# Altium project AMC_Box_Mainboard.PrjPCB (part 1 of 4)
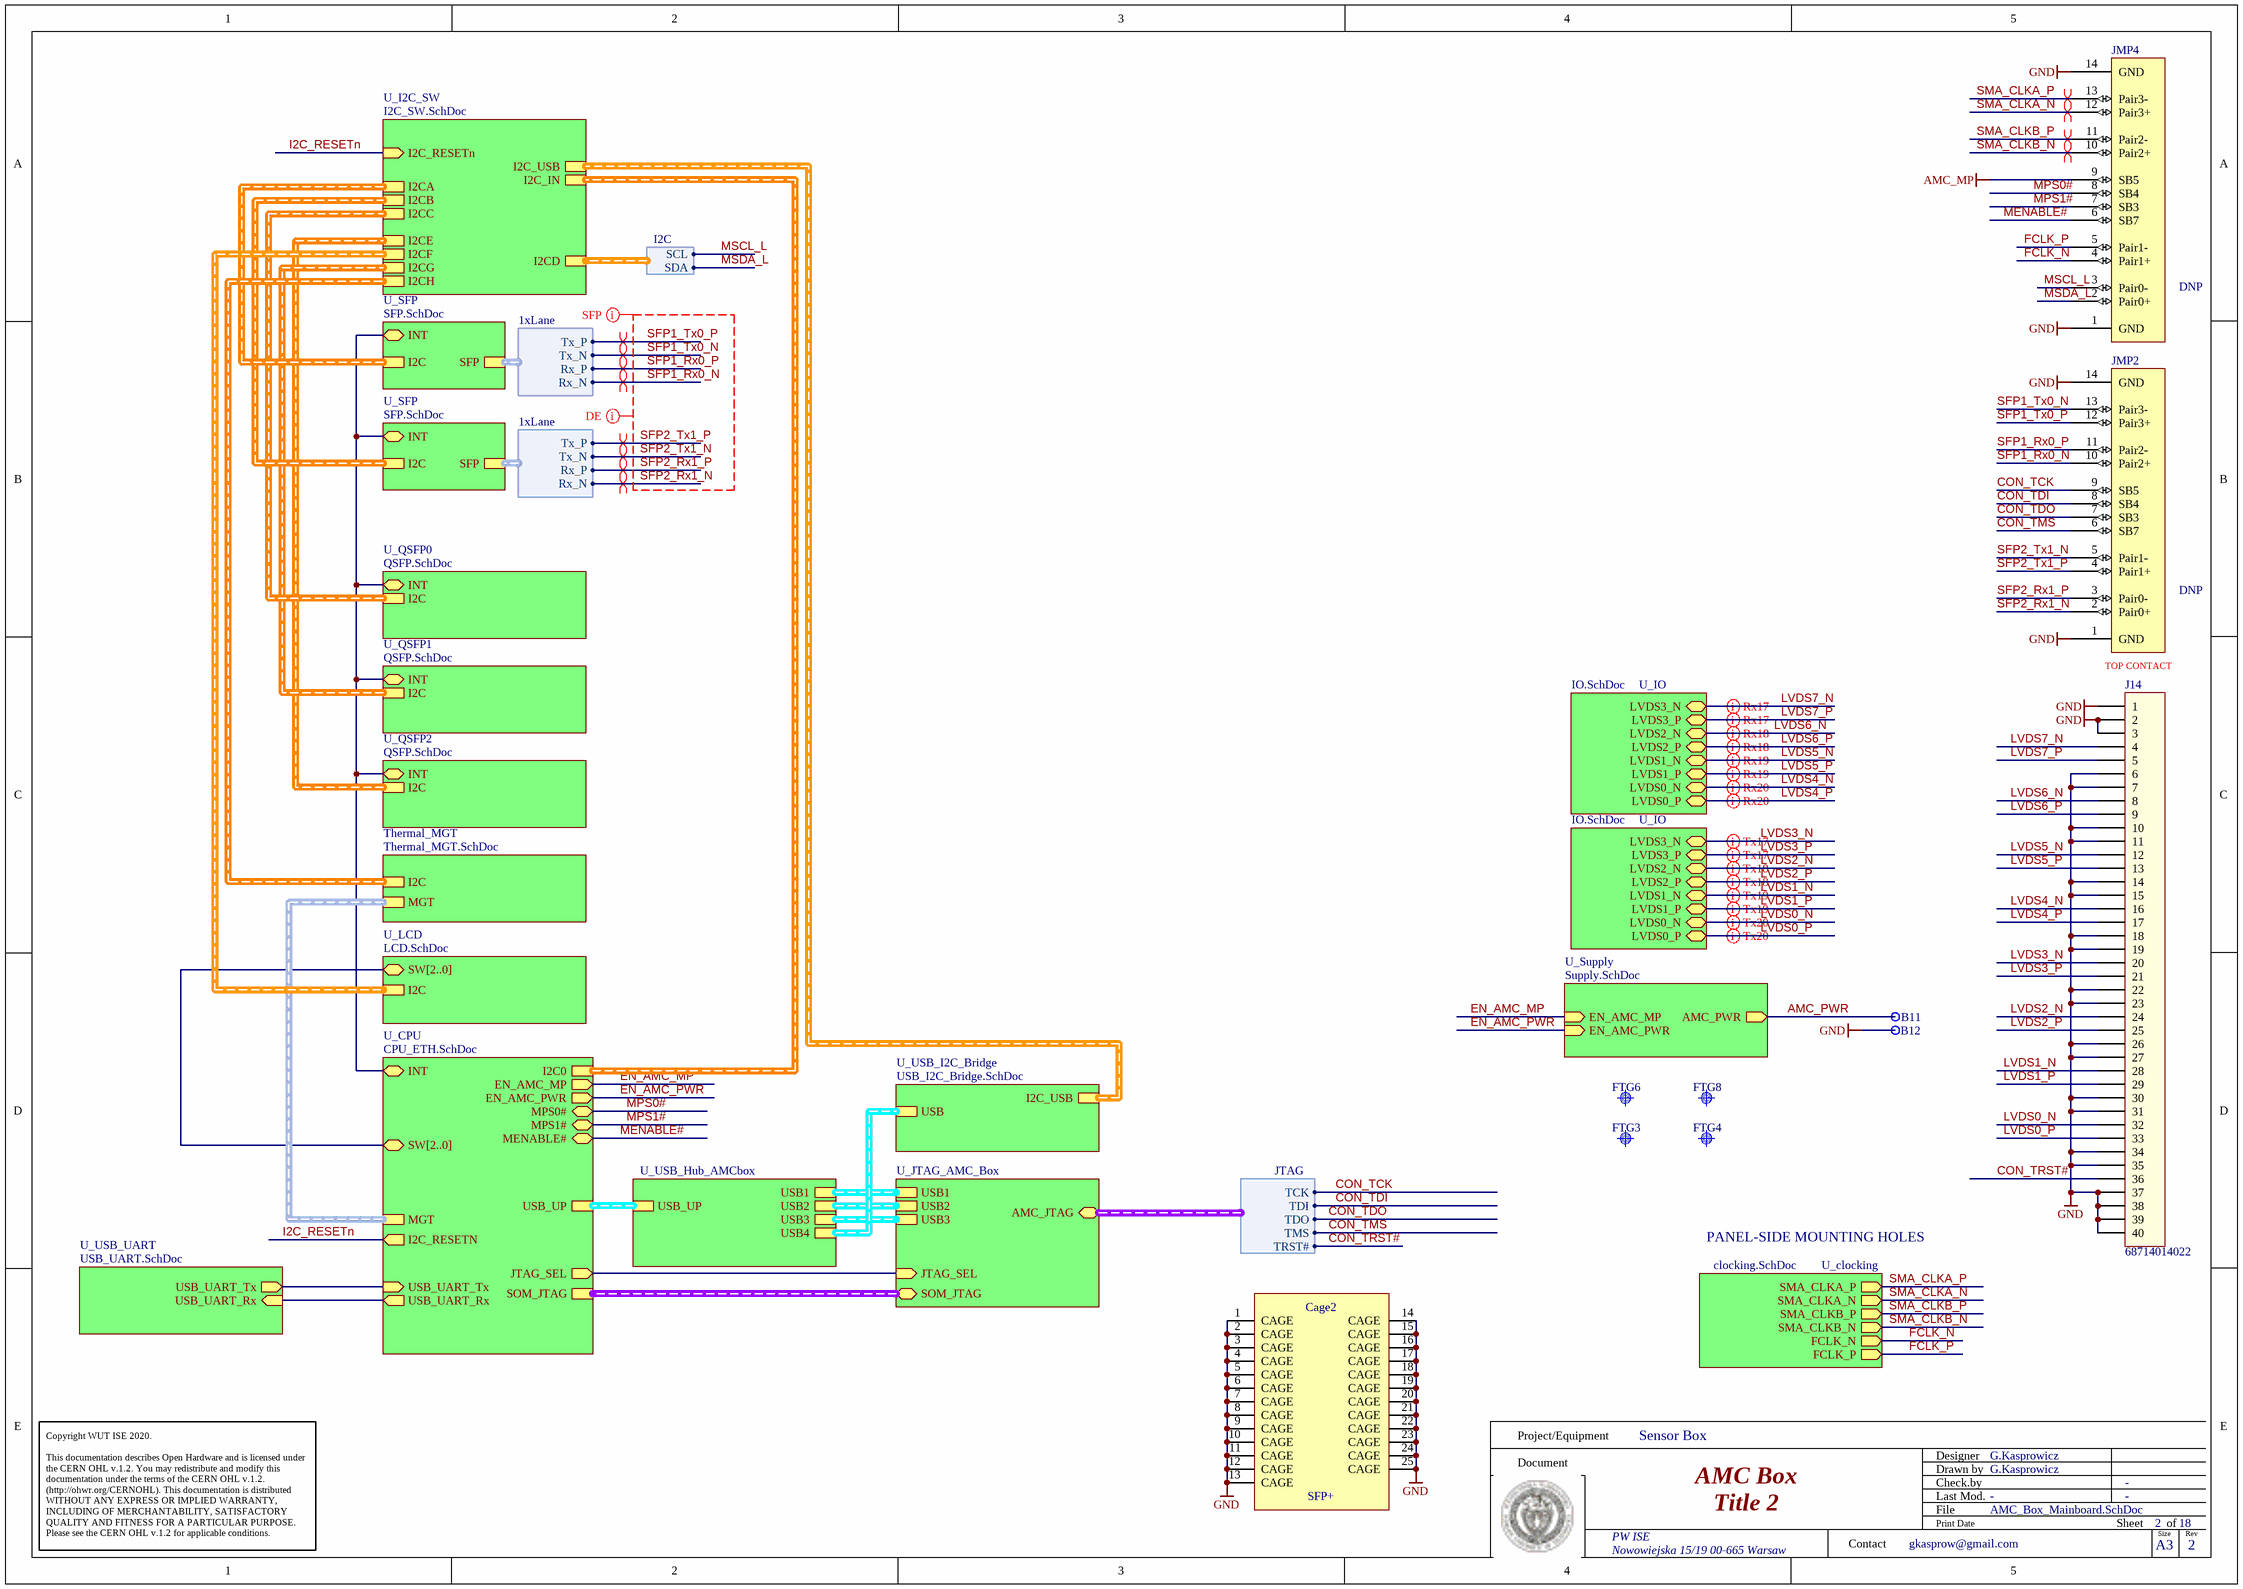
[diagram p0: AMC_Box_Mainboard.SchDoc]
14 sheets, 505 parts. Net scope: hierarchical (ports join the sheet entries above them; power ports are global).
Board file: AMC_Box_Mainboard.PcbDoc
Sheets:
  AMC_Box_Mainboard.SchDoc
    U_Supply = Supply.SchDoc
    U_clocking = clocking.SchDoc
    U_IO = IO.SchDoc
    U_IO = IO.SchDoc
    U_SFP = SFP.SchDoc
    U_SFP = SFP.SchDoc
    U_I2C_SW = I2C_SW.SchDoc
    Thermal_MGT = Thermal_MGT.SchDoc
    U_CPU = CPU_ETH.SchDoc
    U_LCD = LCD.SchDoc
    U_USB_Hub_AMCbox = USB_Hub_AMCbox.SchDoc
    U_USB_UART = USB_UART.SchDoc
    U_JTAG_AMC_Box = JTAG_AMC_Box.SchDoc
    U_USB_I2C_Bridge = USB_I2C_Bridge.SchDoc
    U_QSFP0 = QSFP.SchDoc
    U_QSFP1 = QSFP.SchDoc
    U_QSFP2 = QSFP.SchDoc

## Sheet AMC_Box_Mainboard.SchDoc: AMC Box
size 420 x 297 mm; Author: G.Kasprowicz; CompanyName: WUT ISE; DrawnBy: G.Kasprowicz; Organization: WUT ISE; Address1: PW ISE; Address2: Nowowiejska 15/19 00-665 Warsaw; Address3: gkasprow@gmail.com; DocumentNumber: 2; Revision: 2; SheetNumber: 2; SheetTotal: 18; ModifiedBy: -; CheckedDate: -; Title2: Title 2; DivGrp: WUT ISE; Designer: G.Kasprowicz; ModifiedDate: -; ProjectName: Sensor Box

### Parts
B11  Plated Hole  [c200h150]  (value not drawn)
B12  Plated Hole  [c200h150]  (value not drawn)
Cage2  SFP+  [TYCO_2007263-1]
FTG3  Use only in PCB  [FIDUCIAL_TOP_S100-200]  (value not drawn)
FTG4  Use only in PCB  [FIDUCIAL_TOP_C100-200]  (value not drawn)
FTG6  Use only in PCB  [FIDUCIAL_TOP_S100-200]  (value not drawn)
FTG8  Use only in PCB  [FIDUCIAL_TOP_C100-200]  (value not drawn)
J14  68714014022  [68714014022]
JMP2  DNP  [3M_Twinax_SL8801/12-10DA5-00]
JMP4  DNP  [3M_Twinax_SL8801/12-10DA5-00]

### Sub-sheets
Thermal_MGT = Thermal_MGT.SchDoc: I2C (harness I2C), MGT (harness THERM_MGT)
U_clocking = clocking.SchDoc: SMA_CLKA_P (out), SMA_CLKA_N (out), SMA_CLKB_P (out), SMA_CLKB_N (out), FCLK_N (out), FCLK_P (out)
U_CPU = CPU_ETH.SchDoc: I2C0 (harness I2C), MGT (harness THERM_MGT), EN_AMC_MP (out), EN_AMC_PWR (out), MPS0# (bidir), MPS1# (bidir), MENABLE# (bidir), SW[2..0] (bidir), I2C_RESETN (out), USB_UP (harness USB), USB_UART_Tx (in), USB_UART_Rx (out), SOM_JTAG (harness JTAG), JTAG_SEL (out), INT (bidir)
U_I2C_SW = I2C_SW.SchDoc: I2C_RESETn (in), I2CE (harness I2C), I2CB (harness I2C), I2CA (harness I2C), I2CD (harness I2C), I2CC (harness I2C), I2CG (harness I2C), I2CF (harness I2C), I2CH (harness I2C), I2C_IN (harness I2C), I2C_USB
U_IO = IO.SchDoc: LVDS3_N (bidir), LVDS3_P (bidir), LVDS2_N (bidir), LVDS2_P (bidir), LVDS1_N (bidir), LVDS1_P (bidir), LVDS0_N (bidir), LVDS0_P (bidir)
U_IO = IO.SchDoc: LVDS3_N (bidir), LVDS3_P (bidir), LVDS2_N (bidir), LVDS2_P (bidir), LVDS1_N (bidir), LVDS1_P (bidir), LVDS0_N (bidir), LVDS0_P (bidir)
U_JTAG_AMC_Box = JTAG_AMC_Box.SchDoc: AMC_JTAG (bidir, harness JTAG), SOM_JTAG (bidir, harness JTAG), USB1 (harness USB), USB2 (harness USB), USB3 (harness USB), JTAG_SEL (in)
U_LCD = LCD.SchDoc: I2C, SW[2..0] (bidir)
U_QSFP0 = QSFP.SchDoc: I2C (harness I2C), INT (bidir)
U_QSFP1 = QSFP.SchDoc: I2C (harness I2C), INT (bidir)
U_QSFP2 = QSFP.SchDoc: I2C (harness I2C), INT (bidir)
U_SFP = SFP.SchDoc: I2C (harness I2C), SFP (harness 1xLane), INT (bidir)
U_SFP = SFP.SchDoc: I2C (harness I2C), SFP (harness 1xLane), INT (bidir)
U_Supply = Supply.SchDoc: AMC_PWR (out), EN_AMC_MP (in), EN_AMC_PWR (in)
U_USB_Hub_AMCbox = USB_Hub_AMCbox.SchDoc: USB1 (harness USB), USB2 (harness USB), USB3 (harness USB), USB4 (harness USB), USB_UP (harness USB)
U_USB_I2C_Bridge = USB_I2C_Bridge.SchDoc: I2C_USB (harness I2C), USB (harness USB)
U_USB_UART = USB_UART.SchDoc: USB_UART_Rx (in), USB_UART_Tx (out)

### Harnesses
1xLane: Rx_P, Rx_N, Tx_P, Tx_N
I2C: SCL, SDA
JTAG: TCK, TMS, TDI, TDO, TRST#

### Nets
AMC_MP: JMP4.9(SB5)
GND: B12.1 Cage2.1(CAGE) Cage2.2(CAGE) Cage2.3(CAGE) Cage2.4(CAGE) Cage2.5(CAGE) Cage2.6(CAGE) Cage2.7(CAGE) Cage2.8(CAGE) Cage2.9(CAGE) Cage2.10(CAGE) Cage2.11(CAGE) Cage2.12(CAGE) Cage2.13(CAGE) Cage2.14(CAGE) Cage2.15(CAGE) Cage2.16(CAGE) Cage2.17(CAGE) Cage2.18(CAGE) Cage2.19(CAGE) Cage2.20(CAGE) Cage2.21(CAGE) Cage2.22(CAGE) Cage2.23(CAGE) Cage2.24(CAGE) Cage2.25(CAGE) J14.1 J14.2 J14.3 J14.6 J14.7 J14.10 J14.11 J14.14 J14.15 J14.18 J14.19 J14.22 J14.23 J14.26 J14.27 J14.30 J14.31 J14.34 J14.35 J14.37 J14.38 J14.39 J14.40 JMP2.1(GND) JMP2.14(GND) JMP4.1(GND) JMP4.14(GND)
AMC_PWR: B11.1 ; sheet U_Supply/AMC_PWR
CON_TCK: JMP2.9(SB5) ; sheet U_JTAG_AMC_Box/AMC_JTAG.TCK  [project net AMC_TCK]
CON_TDI: JMP2.8(SB4) ; sheet U_JTAG_AMC_Box/AMC_JTAG.TDI  [project net AMC_TDI]
CON_TDO: JMP2.7(SB3) ; sheet U_JTAG_AMC_Box/AMC_JTAG.TDO  [project net AMC_TDO]
CON_TMS: JMP2.6(SB7) ; sheet U_JTAG_AMC_Box/AMC_JTAG.TMS  [project net AMC_TMS]
CON_TRST#: J14.36 ; sheet U_JTAG_AMC_Box/AMC_JTAG.TRST#  [project net AMC_TRSTn]
EN_AMC_MP: sheet U_Supply/EN_AMC_MP, sheet U_CPU/EN_AMC_MP
EN_AMC_PWR: sheet U_Supply/EN_AMC_PWR, sheet U_CPU/EN_AMC_PWR
FCLK_N: JMP4.4(Pair1+) ; sheet U_clocking/FCLK_N  [project net CLK0_N]
FCLK_P: JMP4.5(Pair1-) ; sheet U_clocking/FCLK_P  [project net CLK0_P]
I2C_RESETn: sheet U_I2C_SW/I2C_RESETn, sheet U_CPU/I2C_RESETN
LVDS0_N: J14.32 ; sheet U_IO/LVDS0_N
LVDS0_P: J14.33 ; sheet U_IO/LVDS0_P
LVDS1_N: J14.28 ; sheet U_IO/LVDS1_N
LVDS1_P: J14.29 ; sheet U_IO/LVDS1_P
LVDS2_N: J14.24 ; sheet U_IO/LVDS2_N
LVDS2_P: J14.25 ; sheet U_IO/LVDS2_P
LVDS3_N: J14.20 ; sheet U_IO/LVDS3_N
LVDS3_P: J14.21 ; sheet U_IO/LVDS3_P
LVDS4_N: J14.16 ; sheet U_IO/LVDS0_N  [project net LVDS0_N]
LVDS4_P: J14.17 ; sheet U_IO/LVDS0_P  [project net LVDS0_P]
LVDS5_N: J14.12 ; sheet U_IO/LVDS1_N  [project net LVDS1_N]
LVDS5_P: J14.13 ; sheet U_IO/LVDS1_P  [project net LVDS1_P]
LVDS6_N: J14.8 ; sheet U_IO/LVDS2_N  [project net LVDS2_N]
LVDS6_P: J14.9 ; sheet U_IO/LVDS2_P  [project net LVDS2_P]
LVDS7_N: J14.4 ; sheet U_IO/LVDS3_N  [project net LVDS3_N]
LVDS7_P: J14.5 ; sheet U_IO/LVDS3_P  [project net LVDS3_P]
MENABLE#: JMP4.6(SB7) ; sheet U_CPU/MENABLE#
MPS0#: JMP4.8(SB4) ; sheet U_CPU/MPS0#
MPS1#: JMP4.7(SB3) ; sheet U_CPU/MPS1#
MSCL_L: JMP4.3(Pair0-) ; sheet U_I2C_SW/I2CD.SCL  [project net I2CD.SCL]
MSDA_L: JMP4.2(Pair0+) ; sheet U_I2C_SW/I2CD.SDA  [project net I2CD.SDA]
SFP1_Rx0_N: JMP2.10(Pair2+) ; sheet U_SFP/SFP.Rx_N  [project net RX_N]
SFP1_Rx0_P: JMP2.11(Pair2-) ; sheet U_SFP/SFP.Rx_P  [project net RX_P]
SFP1_Tx0_N: JMP2.13(Pair3-) ; sheet U_SFP/SFP.Tx_N
SFP1_Tx0_P: JMP2.12(Pair3+) ; sheet U_SFP/SFP.Tx_P
SFP2_Rx1_N: JMP2.2(Pair0+) ; sheet U_SFP/SFP.Rx_N  [project net RX_N]
SFP2_Rx1_P: JMP2.3(Pair0-) ; sheet U_SFP/SFP.Rx_P  [project net RX_P]
SFP2_Tx1_N: JMP2.5(Pair1-) ; sheet U_SFP/SFP.Tx_N
SFP2_Tx1_P: JMP2.4(Pair1+) ; sheet U_SFP/SFP.Tx_P
SMA_CLKA_N: JMP4.12(Pair3+) ; sheet U_clocking/SMA_CLKA_N
SMA_CLKA_P: JMP4.13(Pair3-) ; sheet U_clocking/SMA_CLKA_P
SMA_CLKB_N: JMP4.10(Pair2+) ; sheet U_clocking/SMA_CLKB_N
SMA_CLKB_P: JMP4.11(Pair2-) ; sheet U_clocking/SMA_CLKB_P
NetIC7_2: sheet U_CPU/USB_UART_Tx, sheet U_USB_UART/USB_UART_Tx
NetIC7_9: sheet U_CPU/USB_UART_Rx, sheet U_USB_UART/USB_UART_Rx
NetIC17_1: sheet U_CPU/JTAG_SEL, sheet U_JTAG_AMC_Box/JTAG_SEL
NetIC20_0: sheet U_SFP/INT, sheet U_SFP/INT, sheet U_CPU/INT, sheet U_QSFP0/INT, sheet U_QSFP1/INT, sheet U_QSFP2/INT

### Buses and harness runs
bus sheet U_CPU/SW[2..0] = sheet U_LCD/SW[2..0]
harness sheet Thermal_MGT/I2C = sheet U_I2C_SW/I2CH
harness sheet Thermal_MGT/MGT = sheet U_CPU/MGT
harness sheet U_CPU/I2C0 = sheet U_I2C_SW/I2C_IN
harness sheet U_CPU/SOM_JTAG = sheet U_JTAG_AMC_Box/SOM_JTAG
harness sheet U_CPU/USB_UP = sheet U_USB_Hub_AMCbox/USB_UP
harness sheet U_I2C_SW/I2C_USB = sheet U_USB_I2C_Bridge/I2C_USB
harness sheet U_I2C_SW/I2CA = sheet U_SFP/I2C
harness sheet U_I2C_SW/I2CB = sheet U_SFP/I2C
harness sheet U_I2C_SW/I2CC = sheet U_QSFP0/I2C
harness sheet U_I2C_SW/I2CE = sheet U_QSFP2/I2C
harness sheet U_I2C_SW/I2CF = sheet U_LCD/I2C
harness sheet U_I2C_SW/I2CG = sheet U_QSFP1/I2C
harness sheet U_JTAG_AMC_Box/USB1 = sheet U_USB_Hub_AMCbox/USB1
harness sheet U_JTAG_AMC_Box/USB2 = sheet U_USB_Hub_AMCbox/USB2
harness sheet U_JTAG_AMC_Box/USB3 = sheet U_USB_Hub_AMCbox/USB3
harness sheet U_USB_Hub_AMCbox/USB4 = sheet U_USB_I2C_Bridge/USB

### Layout directives
differential pair: LVDS0_N, LVDS0_P, LVDS1_N, LVDS1_P, LVDS2_N, LVDS2_P, LVDS3_N, LVDS3_P, RX_N, RX_P, SFP1_Tx0_N, SFP1_Tx0_P, SFP2_Tx1_N, SFP2_Tx1_P, SMA_CLKA_N, SMA_CLKA_P, SMA_CLKB_N, SMA_CLKB_P
net class SFP: SFP1_Rx0_N, SFP1_Rx0_P, SFP1_Tx0_N, SFP1_Tx0_P, SFP2_Rx1_N, SFP2_Rx1_P, SFP2_Tx1_N, SFP2_Tx1_P
net class DE: SFP1_Rx0_N, SFP1_Rx0_P, SFP1_Tx0_N, SFP1_Tx0_P, SFP2_Rx1_N, SFP2_Rx1_P, SFP2_Tx1_N, SFP2_Tx1_P

### Notes on the sheet
- TOP CONTACT
- PANEL-SIDE MOUNTING HOLES
- Project/Equipment
- Document
- Designer
- Drawn by
- Check.by
- Copyright WUT ISE 2020.
  This documentation describes Open Hardware and is licensed under the CERN OHL v.1.2. You may redistribute and modify this documentation under the terms of the CERN OHL v.1.2. (http://ohwr.org/CERNOHL). This documentation is distributed WITHOUT ANY EXPRESS OR IMPLIED WARRANTY, INCLUDING OF MERCHANTABILITY, SATISFACTORY QUALITY AND FITNESS FOR A PARTICULAR PURPOSE. Please see the CERN OHL v.1.2 for applicable conditions.
- Contact
- File
- Last Mod.
- Print Date
- Sheet
- Size
- A3
- of
- Rev

### Library data of the parts
B11 B12 = PLATED_HOLE1.5_PAD2.0: Single Terminal Socket; Part Description: Plated Through Hole: Hole Dia.=1.5mm Pad Dia.=2.0mm, IPC-7251 Level C; Mounted: No; Part Number: PLATED_HOLE1.5_PAD2.0; Component Kind: Standard (No BOM); Component Type: Standard (No BOM); Pin Count: 1; Family: Plated Hole; Socket: No; SMD: No; Sense: No; Status: None; ComponentHeight: 0mm; HelpURL: Undefined; Author: CERN DEM JLC; CreateDate: 30.10.2008; LatestRevisionDate: 30.10.2008; PackageDescription: Plated Through Hole: Hole Dia.=1.5mm Pad Dia.=2.0mm, IPC-7251 Level C
Cage2 = TYCO_2007263-1: SFP 1x2 Cage (25Pins); Part Description: 1x2 Press Fit SFP+ Cage with EMI Springs; Manufacturer: TYCO ELECTRONICS; Part Number: TYCO_2007263-1; Component Kind: Standard; Component Type: Standard; Pin Count: 25; Family: SFP+; Mounted: Yes; Socket: No; SMD: No; PressFit: Yes; Sense: No; Status: None; Manufacturer Part Number: 2007263-1; ComponentHeight: 9.7mm; HelpURL: \\cern.ch\dfs\Applications\Altium\Datasheets\TYCO_2007263-1.pdf; Author: CERN DEM JLC; CreateDate: 18.01.2017; LatestRevisionDate: 18.01.2017
FTG3 FTG6 = FIDUCIAL_TARGET_S100-200: Fiducial Target; Part Description: Square Fiducial Target, Top Layer, 1.0mm, Top Solder 2.0mm, Keepout =2.0mm; Mounted: No; Part Number: FIDUCIAL_TARGET_S100-200; Component Kind: Standard (No BOM); Component Type: Standard (No BOM); Pin Count: 1; Family: Fiducial; Socket: No; SMD: Yes; Sense: No; Status: None; ComponentHeight: 0mm; HelpURL: Undefined; Author: CERN DEM JLC; CreateDate: 09.02.2010; LatestRevisionDate: 04.04.2012; PackageDescription: Square Fiducial Target, Top Layer, 1.0mm, Top Solder 2.0mm, Keepout =2.0mm
FTG4 FTG8 = FIDUCIAL_TARGET_C100-200: Fiducial Target; Part Description: Round Fiducial Target, Top Layer, 1.0mm, Top Solder 2.0mm, Keepout =2.0mm; Mounted: No; Part Number: FIDUCIAL_TARGET_C100-200; Component Kind: Standard (No BOM); Component Type: Standard (No BOM); Pin Count: 1; Family: Fiducial; Socket: No; SMD: Yes; Sense: No; Status: None; ComponentHeight: 0mm; HelpURL: Undefined; Author: CERN DEM JLC; CreateDate: 09.02.2010; LatestRevisionDate: 04.04.2012; PackageDescription: Round Fiducial Target, Top Layer, 1.0mm, Top Solder 2.0mm, Keepout =2.0mm
J14 = 68714014022: 0.50 mm SMT ZIF Horizontal Top Contact WR-FPC, 40 pins; Pitch: 0.5 mm; Pin Number: 40; ComponentLink1Description: Manufacturer; ComponentLink1URL: http://www.we-online.de; ComponentLink2Description: Datasheet; ComponentLink2URL: http://katalog.we-online.com/em/datasheet/6871xx14022.pdf; Part Number: 68714014022; Published Date: April 2017; Publisher: Wurth Elektronik
JMP2 JMP4 = CBL_TWINAX_3M_4pairs_SB: Flat Ribbon Cable Silver 8 (4 Pair) Conductors 0.093" (2.37mm) Between Pairs Flat Twin Axial 500.0' (152.40m)

## Sheet Supply.SchDoc: Power
size 420 x 297 mm; Author: G.Kasprowicz; CompanyName: WUT ISE; DrawnBy: G.Kasprowicz; Organization: WUT ISE; Address1: PW ISE; Address2: Nowowiejska 15/19 00-665 Warsaw; Address3: gkasprow@gmail.com; DocumentNumber: 11; Revision: 2; SheetNumber: 11; SheetTotal: 18; ModifiedBy: -; CheckedDate: -; Title2: Supply; DivGrp: WUT ISE; Designer: G.Kasprowicz; ModifiedDate: -; ProjectName: Sensor Box
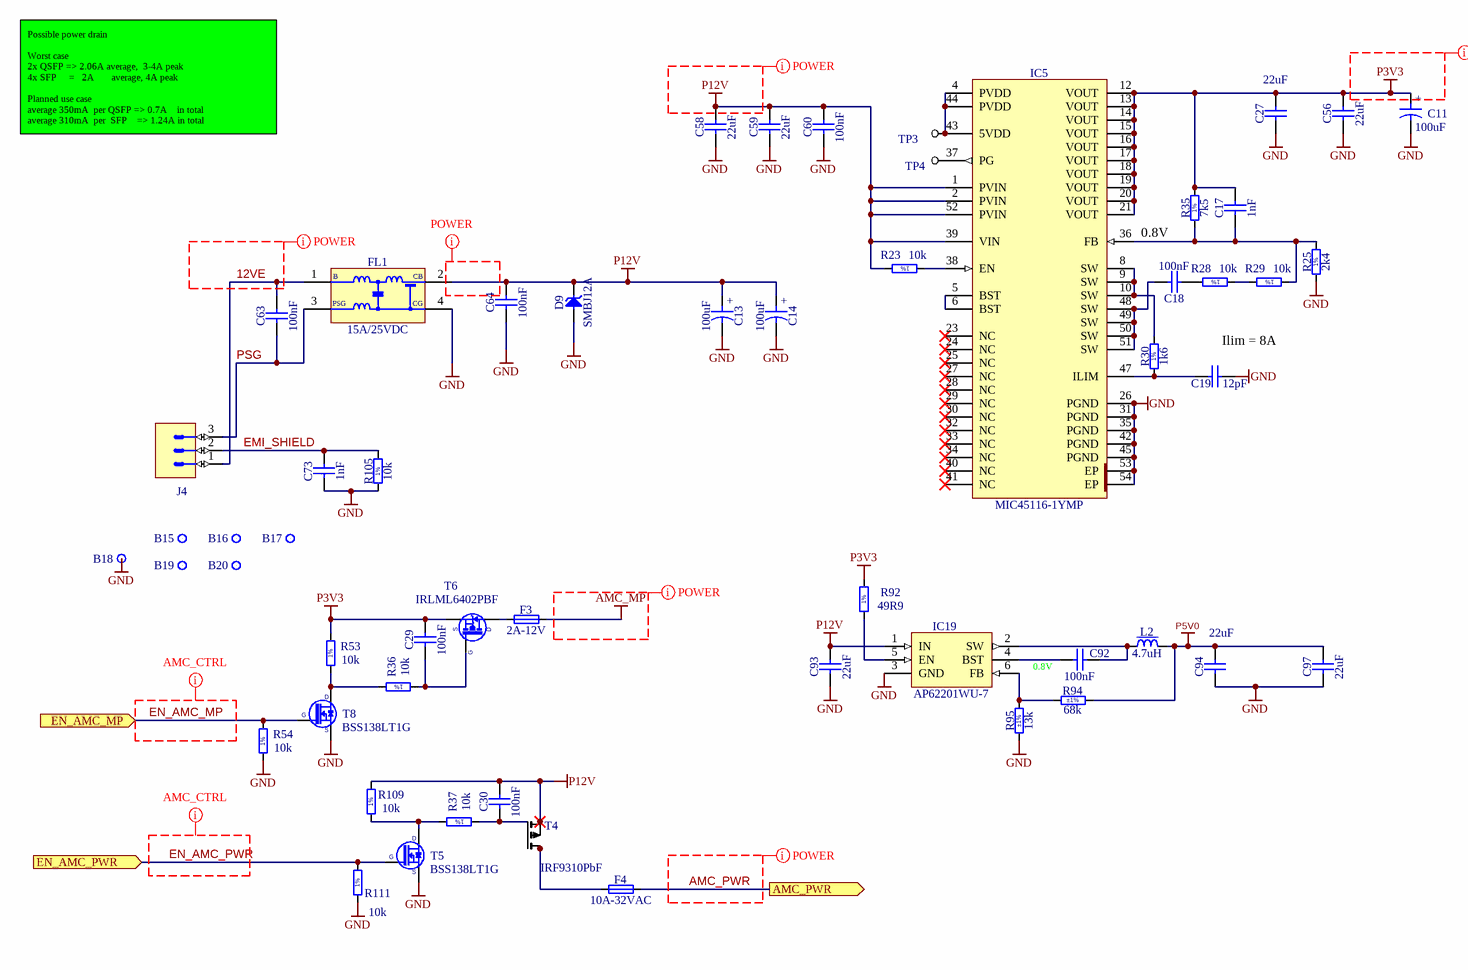
[diagram p1: Supply.SchDoc]

### Parts
B15  Plated Hole  [MTG320_550]  (value not drawn)
B16  Plated Hole  [MTG320_550]  (value not drawn)
B17  Plated Hole  [MTG320_550]  (value not drawn)
B18  Plated Hole  [MTG320_550]  (value not drawn)
B19  Plated Hole  [MTG320_550]  (value not drawn)
B20  Plated Hole  [MTG320_550]  (value not drawn)
C11  100uF  [CAPAE660X540N]
C13  100uF  [CAPAE660X540N]
C14  100uF  [CAPAE660X540N]
C17  1nF  [CAPC1005X55N]
C18  100nF  [CAPC1005X55N]
C19  12pF  [CAPC1005X55N]
C27  22uF  [CAPC2012X145N]
C29  100nF  [CAPC1005X55N]
C30  100nF  [CAPC1005X55N]
C56  22uF  [CAPC2012X145N]
C58  22uF  [CAPC2012X145N]
C59  22uF  [CAPC2012X145N]
C60  100nF  [CAPC1005X55N]
C63  100nF  [CAPC1005X55N]
C64  100nF  [CAPC1005X55N]
C73  1nF  [CAPC1005X55N]
C92  100nF  [CAPC1005X55N]
C93  22uF  [CAPC2012X145N]
C94  22uF  [CAPC2012X145N]
C97  22uF  [CAPC2012X145N]
D9  SMBJ12A  [DIOM5336X265N]
F3  2A-12V  [FUSR_LITTELFUSE_1812L200]
F4  10A-32VAC  [FUSE_SCHURTER_UST1206]
FL1  15A/25VDC  [FIL_MURATA_BNX016]
IC5  MIC45116-1YMP  [MICROCHIP_H3QFN88-52LD-PL-3]
IC19  AP62201WU-7  [SOT95P285X110-6N]
J4  (no value)  [PHOENIX_1755749]
L2  4.7uH  [INDM5552X200N]
R23  10k  [RESC1005X40N]
R25  2k4  [RESC1005X40N]
R28  10k  [RESC1005X40N]
R29  10k  [RESC1005X40N]
R30  1k6  [RESC1005X40N]
R35  7k5  [RESC1005X40N]
R36  10k  [RESC1005X40N]
R37  10k  [RESC1005X40N]
R53  10k  [RESC1005X40N]
R54  10k  [RESC1005X40N]
R92  49R9  [RESC1005X40N]
R94  68k  Tolerance: ±1%  [RESC1005X40N]
R95  13k  Tolerance: ±1%  [RESC1005X40N]
R105  10k  [RESC1005X40N]
R109  10k  [RESC1005X40N]
R111  10k  [RESC1005X40N]
T4  IRF9310PbF  [so-8]
T5  BSS138LT1G  [SOT95P240X110-3N]
T6  IRLML6402PBF  [SOT95P237X112-3N]
T8  BSS138LT1G  [SOT95P240X110-3N]
TP3  TP  [TP]  (value not drawn)
TP4  TP  [TP]  (value not drawn)

### Ports
AMC_PWR (out), EN_AMC_MP (in), EN_AMC_PWR (in)

### Nets
AMC_MP: F3.2
GND: B18.1 C11.2 C13.2 C14.2 C19.1 C27.1 C56.1 C58.1 C59.1 C60.1 C64.1 C73.1 C93.1 C94.1 C97.1 D9.2(A) FL1.4(CG) IC5.26(PGND) IC5.31(PGND) IC5.35(PGND) IC5.42(PGND) IC5.45(PGND) IC5.53(EP) IC5.54(EP) IC19.3(GND) R25.1 R54.1 R95.1 R105.1 R111.1 T5.2(S) T8.2(S)
P3V3: C11.1 C17.2 C27.2 C29.2 C56.2 IC5.12(VOUT) IC5.13(VOUT) IC5.14(VOUT) IC5.15(VOUT) IC5.16(VOUT) IC5.17(VOUT) IC5.18(VOUT) IC5.19(VOUT) IC5.20(VOUT) IC5.21(VOUT) R35.2 R53.2 R92.2 T6.2(S)
P5V0: C94.2 C97.2 L2.2 R94.2
P12V: C13.1 C14.1 C30.2 C58.2 C59.2 C60.2 C64.2 C93.2 D9.1(C) FL1.2(CB) IC5.1(PVIN) IC5.2(PVIN) IC5.39(VIN) IC5.52(PVIN) IC19.1(IN) R23.2 R109.2 T4.1(S1) T4.2(S1) T4.3(S1)
12VE: C63.2 FL1.1(B) J4.1
AMC_PWR: F4.2 ; port AMC_PWR
EMI_SHIELD: C73.2 J4.2 R105.2
EN_AMC_MP: R54.2 T8.1(G) ; port EN_AMC_MP
EN_AMC_PWR: R111.2 T5.1(G) ; port EN_AMC_PWR
PSG: C63.1 FL1.3(PSG) J4.3
NetC17_1: C17.1 IC5.36(FB) R25.2 R29.1 R35.1
NetC18_1: C18.1 R28.2
NetC18_2: C18.2 IC5.48(SW) IC5.49(SW) IC5.50(SW) IC5.51(SW)
NetC19_2: C19.2 IC5.47(ILIM) R30.1
NetC29_1: C29.1 R36.1 T6.1(G)
NetC30_1: C30.1 R37.1 T4.4(G1)
NetC92_1: C92.1 IC19.4(BST)
NetC92_2: C92.2 IC19.2(SW) L2.1
NetF3_1: F3.1 T6.3(D)
NetF4_1: F4.1 T4.5(D1) T4.6(D1) T4.7(D1) T4.8(D1)
NetIC5_4: IC5.4(PVDD) IC5.43(5VDD) IC5.44(PVDD) TP3.1
NetIC5_5: IC5.5(BST) IC5.6(BST)
NetIC5_8: IC5.8(SW) IC5.9(SW) IC5.10(SW) R30.2
NetIC5_37: IC5.37(PG) TP4.1
NetIC5_38: IC5.38(EN) R23.1
NetIC19_5: IC19.5(EN) R92.1
NetIC19_6: IC19.6(FB) R94.1 R95.2
NetR28_1: R28.1 R29.2
NetR36_2: R36.2 R53.1 T8.3(D)
NetR37_2: R37.2 R109.1 T5.3(D)

Not connected (* = marked no-connect by the designer): B15 1; B16 1; B17 1; B19 1; B20 1; IC5 23(NC)* 24(NC)* 25(NC)* 27(NC)* 28(NC)* 29(NC)* 30(NC)* 32(NC)* 33(NC)* 34(NC)* 40(NC)* 41(NC)*

### Layout directives
net class POWER: 12VE, (no net found under the mark), AMC_MP, AMC_PWR, P3V3, P12V
net class AMC_CTRL: EN_AMC_MP, EN_AMC_PWR

### Notes on the sheet
- Possible power drain
  Worst case
  2x QSFP => 2.06A average,  3-4A peak
  4x SFP     =   2A       average, 4A peak
  Planned use case
  average 350mA  per QSFP => 0.7A    in total
  average 310mA  per  SFP    => 1.24A in total
- 0.8V
- (near C19) Ilim = 8A
- Project/Equipment
- Document
- Designer
- Drawn by
- Check.by
- Copyright WUT ISE 2020.
  This documentation describes Open Hardware and is licensed under the CERN OHL v.1.2. You may redistribute and modify this documentation under the terms of the CERN OHL v.1.2. (http://ohwr.org/CERNOHL). This documentation is distributed WITHOUT ANY EXPRESS OR IMPLIED WARRANTY, INCLUDING OF MERCHANTABILITY, SATISFACTORY QUALITY AND FITNESS FOR A PARTICULAR PURPOSE. Please see the CERN OHL v.1.2 for applicable conditions.
- Contact
- File
- Last Mod.
- Print Date
- Sheet
- Size
- A3
- of
- Rev
- (in symbol CAE660-540_100UF_16V_20%) +
- (in symbol R0402_1K6_1%_0.0625W_100PPM) 1%
- (in symbol R0402_2K4_1%_0.0625W_100PPM) 1%
- (in symbol R0402_7K5_1%_0.0625W_100PPM) 1%
- (in symbol R0402_10K_1%_0.0625W_100PPM) 1%
- (in symbol R0402_49R9_1%_0.0625W_100PPM) 1%

### Library data of the parts
B15-B20 = PLATED_HOLE3.2_PAD5.5: Single Terminal Socket; Part Description: Plated Through Hole: Hole Dia.=3.2mm Pad Dia.=5.5mm; Mounted: No; Part Number: PLATED_HOLE3.2_PAD5.5; Component Kind: Standard (No BOM); Component Type: Standard (No BOM); Pin Count: 1; Family: Plated Hole; Socket: No; SMD: No; Sense: No; Status: None; ComponentHeight: 0mm; HelpURL: Undefined; Author: CERN DEM JMW; CreateDate: 01.10.2012; LatestRevisionDate: 01.10.2012; PackageDescription: Plated Through Hole: Hole Dia.=3.2mm Pad Dia.=5.5mm
C11 C13 C14 = CAE660-540_100UF_16V_20%: Polarised capacitor; Part Description: Aluminum Electrolytic SMT Capacitor; Manufacturer: PANASONIC; Manufacturer Part Number: EEEFK1C101AP; Voltage: 16V; Tolerance: ±20%; Part Number: CAE660-540_100UF_16V_20%; Component Kind: Standard; Component Type: Standard; Pin Count: 2; Value: 100uF; Status: Not Recommended; Case: D; Mounted: Yes; Socket: No; SMD: Yes; Sense: No; ComponentHeight: 5.8mm; HelpURL: \\cern.ch\dfs\Applications\Altium\Datasheets\CAE_PANASONIC_FK.pdf; Author: CERN DEM JLC; CreateDate: 03.12.2007; LatestRevisionDate: 05.11.2014
C17 C73 = CC0402_1NF_50V_10%_X7R: Non-polarised capacitor; Part Description: SMD Multilayer Chip Ceramic Capacitor; Manufacturer: GENERIC; Manufacturer1 Part Number: 223858715623; Voltage: 50V; TC: X7R; Tolerance: ±10%; Part Number: CC0402_1NF_50V_10%_X7R; Component Kind: Standard; Component Type: Standard; Pin Count: 2; Value: 1nF; Status: Not Recommended; Manufacturer Part Number: CC0402_1NF_50V_10%_X7R; Case: 0402; Mounted: Yes; Socket: No; SMD: Yes; Sense: No; Manufacturer1 Example: PHYCOMP; Manufacturer1 ComponentHeight: 0.55mm; HelpURL: \\cern.ch\dfs\Applications\Altium\Datasheets\CC0402_X7R_PHYCOMP.pdf; Author: CERN DEM JLC; CreateDate: 03.12.2007; LatestRevisionDate: 03.12.2007
C18 C29 C30 C60 C63 C64 C92 = CC0402_100NF_16V_10%_X5R: Non-polarised capacitor; Part Description: SMD Multilayer Chip Ceramic Capacitor; Manufacturer: GENERIC; Manufacturer1 Part Number: GRM155R61C104KA88D; Voltage: 16V; TC: X5R; Tolerance: ±10%; Table: Capacitors SMD; Part Number: CC0402_100NF_16V_10%_X5R; Component Kind: Standard; Component Type: Standard; Pin Count: 2; Value: 100nF; Status: None; Manufacturer Part Number: CC0402_100NF_16V_10%_X5R; Case: 0402; Mounted: Yes; Socket: No; SMD: Yes; Manufacturer1 Example: MURATA; Manufacturer1 ComponentHeight: 0.55mm; HelpURL: \\cern.ch\dfs\Applications\Altium\Datasheets\CC0402_X5R_MURATA_GRM.pdf; Author: CERN DEM JLC; CreateDate: 2013-12-10; LatestRevisionDate: 2013-12-10
C19 = CC0402_12PF_50V_5%_C0G: Non-polarised capacitor; Part Description: SMD Multilayer Chip Ceramic Capacitor; Manufacturer: GENERIC; Manufacturer1 Part Number: C0402C120J5GACTU; Voltage: 50V; TC: C0G/NP0; Tolerance: ±5%; Part Number: CC0402_12PF_50V_5%_C0G; Component Kind: Standard; Component Type: Standard; Pin Count: 2; Value: 12pF; Status: Preferred; Manufacturer Part Number: CC0402_12PF_50V_5%_C0G; Case: 0402; Mounted: Yes; Socket: No; SMD: Yes; Sense: No; Manufacturer1 Example: KEMET; Manufacturer1 ComponentHeight: 0.55mm; HelpURL: \\cern.ch\dfs\Applications\Altium\Datasheets\CC0805_C0G_KEMET_(Commercial Grade).pdf; Author: CERN DEM JLC; CreateDate: 04.10.2016; LatestRevisionDate: 04.10.2016
C27 C56 C58 C59 C93 C94 C97 = CC0805_22UF_25V_20%_X5R: Non-polarised capacitor; Part Description: Chip Multilayer Ceramic Capacitor for General Purpose; Manufacturer: GENERIC; Manufacturer1 Part Number: GRM21BR61E226ME44; Voltage: 25V; TC: X5R; Tolerance: ±20%; Part Number: CC0805_22UF_25V_20%_X5R; Component Kind: Standard; Component Type: Standard; Pin Count: 2; Value: 22uF; Status: Preferred; Manufacturer Part Number: CC0805_22UF_25V_20%_X5R; Case: 0805; Mounted: Yes; Socket: No; SMD: Yes; Manufacturer1 Example: MURATA; Manufacturer1 ComponentHeight: 1.45mm; HelpURL: \\cern.ch\dfs\Applications\Altium\Datasheets\CC0805_MURATA_GRM21BR61E226ME44.pdf; Author: CERN DEM WB; CreateDate: 08.10.2021; LatestRevisionDate: 08.10.2021; Sense: No; ComponentHeight: 1.45mm
D9 = SMBJ12A: Zener Diode; Part Description: Uni-Directional Transient Voltage Suppressor Diode; Manufacturer: FAIRCHILD SEMICONDUCTOR; Voltage: 12V; Power: 600W; PressFit: No; Bonding: No; Part Number: SMBJ12A; Component Kind: Standard; Component Type: Standard; Device: SMBJ12A; PackageDescription: DO-214-AA/SMB Diode, Molded Body; 5.34mm L X 3.625mm W X 2.65mm H, IPC Medium Density; Manufacturer Part Number: SMBJ12A; Pin Count: 2; Case: DO-214AA; Mounted: Yes; Socket: No; SMD: Yes; Sense: No; ComponentHeight: 2.65mm; HelpURL: \\cern.ch\dfs\Applications\Altium\Datasheets\SMBJ.pdf; Author: CERN DEM JLC; CreateDate: 10.04.2013; LatestRevisionDate: 10.04.2013
F3 = FUSR1812_LITTELFUSE_1812L200/12: Fuse; Part Description: POLYFUSE® Surface Mount Resettable PTC; Manufacturer Part Number: 1812L200/12DR; PressFit: No; Part Number: FUSR1812_LITTELFUSE_1812L200/12; Component Kind: Standard; Component Type: Standard; Pin Count: 2; PackageDescription: Surface Mount POLY-FUSE® Resettable PTC, Body 4.55x3.24mm, 1812L Series; Family: Fuses Resettable; Mounted: Yes; Socket: No; SMD: Yes; Sense: No; Value: 2A-12V; Manufacturer: LITTELFUSE; ComponentHeight: 1.2mm; HelpURL: \\cern.ch\dfs\Applications\Altium\Datasheets\FUSR_LITTELFUSE_1812L.pdf; Author: CERN DEM BC; CreateDate: 23.03.2021; LatestRevisionDate: 23.03.2021
F4 = FUSE_SCHURTER_3413.0328.22: Fuse; Part Description: SMD Fuse, Time-Lag T, UST 1206 Series; PressFit: No; Part Number: FUSE_SCHURTER_3413.0328.22; Component Kind: Standard; Component Type: Standard; Pin Count: 2; Case: 1206; PackageDescription: Chip Fuse, 2-Leads, Body 3.2mm x 1.6mm x 0.6mm; Family: Fuse; Mounted: Yes; Socket: No; SMD: Yes; Sense: No; Value: 10A-32VAC; Manufacturer: SCHURTER; Manufacturer Part Number: 3413.0328.22; ComponentHeight: 0.6mm; HelpURL: \\cern.ch\dfs\Applications\Altium\Datasheets\FUSE_SCHURTER_UST1206.pdf; Author: CERN DEM BC; CreateDate: 15.11.2019; LatestRevisionDate: 15.11.2019
FL1 = FIL_MURATA_BNX016-01: Block Type EMIFIL (LC Combined) SMD Type, BNX01* Serie; Part Description: Block Type EMIFIL (LC Combined), BNX01* Series; Manufacturer: MURATA; Part Number: FIL_MURATA_BNX016-01; Component Kind: Standard; Component Type: Standard; Pin Count: 6; Value: 15A/25VDC; Manufacturer Part Number: BNX016-01; Mounted: Yes; Socket: No; SMD: No; Sense: No; ComponentHeight: 8.5mm; HelpURL: \\cern.ch\dfs\Applications\Altium\Datasheets\FIL_MURATA_BNX016-01.pdf; Author: CERN DEM JLC; CreateDate: 20.01.2014; LatestRevisionDate: 20.01.2014
IC5 = MIC45116-1YMP: 0.8V to 85% PVIN (4.75-19V), 6A Synchronous Step-Down Regulator Module; Manufacturer: MICROCHIP TECHNOLOGY; PressFit: No; Bonding: No; Part Number: MIC45116-1YMP; Component Kind: Standard; Component Type: Standard; Device: MIC45116-1YMP; PackageDescription: MICROCHIP_H3QFN88-52LD-PL-3, 0.50mm Pitch, Square, 52 Pin, 8mm L X 8mm W X 3mm H Body; Part Description: 0.8V to 85% PVIN (4.75-19V), 6A Synchronous Step-Down Regulator Module; Manufacturer Part Number: MIC45116-1YMP; Pin Count: 53; Mounted: Yes; Socket: No; SMD: Yes; Sense: No; ComponentHeight: 3mm; HelpURL: \\cern.ch\dfs\Applications\Altium\Datasheets\MIC45116-1YMP.pdf; Author: CERN DEM JMW; CreateDate: 15.08.2016; LatestRevisionDate: 15.08.2016
IC19 = PM_AP65111A: LIGHT LOAD IMPROVED 1.5A SYNCH DC/DC BUCK CONVERTER; Manufacturer: DIODES INCORPORATED; PressFit: No; Bonding: No; Part Number: AP62201WU-7; Component Kind: Standard; Component Type: Standard; Device: AP62201WU-7; PackageDescription: SOT23, 0.95mm pitch; 6 pin, 1.6mm W X 3.0mm L X 1.45mm H body, IPC Medium Density; Part Description: LIGHT LOAD IMPROVED 1.5A SYNCH DC/DC BUCK CONVERTER; Manufacturer Part Number: AP62201WU-7; Pin Count: 5; Case: SOT26; Mounted: Yes; Socket: No; SMD: Yes; Sense: No; ComponentHeight: 1.45mm; HelpURL: \\cern.ch\dfs\Applications\Altium\Datasheets\AP133-WG-7.pdf; Author: GK; CreateDate: 10.07.2015; LatestRevisionDate: 10.07.2015
J4 = PHOENIX_1755749: Connector 3 Male; Part Description: 12A, 250V, Pitch 5.08mm, 3 Positions Header; Manufacturer: PHOENIX CONTACT; Manufacturer Part Number: 1755749 (MSTBVA 2,5/3-G-5,08); PressFit: No; Part Number: PHOENIX_1755749; Component Kind: Standard; Component Type: Standard; Pin Count: 3; Mounted: Yes; Socket: No; SMD: No; Sense: No; Status: None; ComponentHeight: 12mm; HelpURL: \\cern.ch\dfs\Applications\Altium\Datasheets\PHOENIX_1755749.pdf; Author: CERN DEM JLC; CreateDate: 13.11.2013; LatestRevisionDate: 13.11.2013
L2 = IND2020_4.7UH_20%_VISHAY_IHLP-2020BZ-11: Inductor With Core; Part Description: Low Profile, High Current IHLP® Inductor; Manufacturer: VISHAY DALE; Manufacturer Part Number: IHLP2020BZER4R7M11; Power: 3.2A; Resistance: 0.0813R; Tolerance: ±20%; Part Number: IND2020_4.7UH_20%_VISHAY_IHLP-2020BZ-11; Component Kind: Standard; Component Type: Standard; Pin Count: 2; Value: 4.7uH; Case: 2020; Mounted: Yes; Socket: No; SMD: Yes; Sense: No; ComponentHeight: 2mm; HelpURL: \\cern.ch\dfs\Applications\Altium\Datasheets\IND2020_VISHAY_IHLP2020BZ-11.pdf; Author: CERN DEM JLC; CreateDate: 23.07.2014; LatestRevisionDate: 23.07.2014
R23 R28 R29 R36 R37 R53 R54 R109 R111 = R0402_10K_1%_0.0625W_100PPM: Resistor - 1%; Part Description: General Purpose Thick Film Chip Resistor; Manufacturer: GENERIC; Manufacturer1 Part Number: 232270671003L; TC: ±100ppm/°C; Table: Resistors SMD; Part Number: R0402_10K_1%_0.0625W_100PPM; Component Kind: Standard; Component Type: Standard; Pin Count: 2; Value: 10k; Status: Not recommended; Power: 0.0625W; Tolerance: ±1%; Manufacturer Part Number: R0402_10K_1%_0.0625W_100PPM; Case: 0402; Mounted: Yes; Socket: No; SMD: Yes; Manufacturer1 Example: YAGEO PHYCOMP; Manufacturer1 ComponentHeight: 0.4mm; HelpURL: \\cern.ch\dfs\Applications\Altium\Datasheets\R0402_Phycomp_RC0402.pdf; Author: CERN DEM JLC; CreateDate: 2007-12-03; LatestRevisionDate: 2012-10-17
R25 = R0402_2K4_1%_0.0625W_100PPM: Resistor - 1%; Part Description: General Purpose Thick Film Chip Resistor; Manufacturer: GENERIC; Manufacturer1 Part Number: 232270672402L; TC: ±100ppm/°C; PressFit: No; Part Number: R0402_2K4_1%_0.0625W_100PPM; Component Kind: Standard; Component Type: Standard; Pin Count: 2; Value: 2k4; Status: Not Recommended; Power: 0.0625W; Tolerance: ±1%; Manufacturer Part Number: R0402_2K4_1%_0.0625W_100PPM; Case: 0402; Mounted: Yes; Sense: No; Socket: No; SMD: Yes; Manufacturer1 Example: YAGEO PHYCOMP; Manufacturer1 ComponentHeight: 0.4mm; HelpURL: \\cern.ch\dfs\Applications\Altium\Datasheets\R0402_Phycomp_RC0402.pdf; Author: CERN DEM JLC; CreateDate: 03.12.2007; LatestRevisionDate: 17.10.2012
R30 = R0402_1K6_1%_0.0625W_100PPM: Resistor - 1%; Part Description: General Purpose Thick Film Chip Resistor; Manufacturer: GENERIC; Manufacturer1 Part Number: 232270671602L; TC: ±100ppm/°C; PressFit: No; Part Number: R0402_1K6_1%_0.0625W_100PPM; Component Kind: Standard; Component Type: Standard; Pin Count: 2; Value: 1k6; Status: Not Recommended; Power: 0.0625W; Tolerance: ±1%; Manufacturer Part Number: R0402_1K6_1%_0.0625W_100PPM; Case: 0402; Mounted: Yes; Sense: No; Socket: No; SMD: Yes; Manufacturer1 Example: YAGEO PHYCOMP; Manufacturer1 ComponentHeight: 0.4mm; HelpURL: \\cern.ch\dfs\Applications\Altium\Datasheets\R0402_Phycomp_RC0402.pdf; Author: CERN DEM JLC; CreateDate: 03.12.2007; LatestRevisionDate: 17.10.2012
R35 = R0402_7K5_1%_0.0625W_100PPM: Resistor - 1%; Part Description: General Purpose Thick Film Chip Resistor; Manufacturer: GENERIC; Manufacturer1 Part Number: 232270677502L; TC: ±100ppm/°C; PressFit: No; Part Number: R0402_7K5_1%_0.0625W_100PPM; Component Kind: Standard; Component Type: Standard; Pin Count: 2; Value: 7k5; Status: Not Recommended; Power: 0.0625W; Tolerance: ±1%; Manufacturer Part Number: R0402_7K5_1%_0.0625W_100PPM; Case: 0402; Mounted: Yes; Sense: No; Socket: No; SMD: Yes; Manufacturer1 Example: YAGEO PHYCOMP; Manufacturer1 ComponentHeight: 0.4mm; HelpURL: \\cern.ch\dfs\Applications\Altium\Datasheets\R0402_Phycomp_RC0402.pdf; Author: CERN DEM JLC; CreateDate: 03.12.2007; LatestRevisionDate: 17.10.2012
R92 = R0402_49R9_1%_0.0625W_100PPM: Resistor - 1%; Part Description: General Purpose Thick Film Chip Resistor; Manufacturer: GENERIC; Manufacturer1 Part Number: 232270674999L or RC0402FR-0749R9L; TC: ±100ppm/°C; Table: Resistors SMD; Part Number: R0402_49R9_1%_0.0625W_100PPM; Component Kind: Standard; Component Type: Standard; Pin Count: 2; Value: 49R9; Status: Not recommended; Power: 0.0625W; Tolerance: ±1%; Manufacturer Part Number: R0402_49R9_1%_0.0625W_100PPM; Case: 0402; Mounted: Yes; Socket: No; SMD: Yes; Manufacturer1 Example: YAGEO PHYCOMP; Manufacturer1 ComponentHeight: 0.4mm; HelpURL: \\cern.ch\dfs\Applications\Altium\Datasheets\R0402_Phycomp_RC0402.pdf; Author: CERN DEM JLC; CreateDate: 2012-10-24; LatestRevisionDate: 2012-10-24
R94 = R0402_68K_1%_0.0625W_100PPM: Resistor - 1%; Part Description: General Purpose Thick Film Chip Resistor; Manufacturer: GENERIC; Manufacturer1 Part Number: 232270676803L; TC: ±100ppm/°C; PressFit: No; Part Number: R0402_68K_1%_0.0625W_100PPM; Component Kind: Standard; Component Type: Standard; Pin Count: 2; Value: 68k; Status: Not Recommended; Power: 0.0625W; Manufacturer Part Number: R0402_68K_1%_0.0625W_100PPM; Case: 0402; Mounted: Yes; Sense: No; Socket: No; SMD: Yes; Manufacturer1 Example: YAGEO PHYCOMP; Manufacturer1 ComponentHeight: 0.4mm; HelpURL: \\cern.ch\dfs\Applications\Altium\Datasheets\R0402_Phycomp_RC0402.pdf; Author: CERN DEM JLC; CreateDate: 03.12.2007; LatestRevisionDate: 17.10.2012
R95 = R0402_13K_1%_0.0625W_100PPM: Resistor - 1%; Part Description: General Purpose Thick Film Chip Resistor; Manufacturer: GENERIC; Manufacturer1 Part Number: 232270671303L; TC: ±100ppm/°C; PressFit: No; Part Number: R0402_13K_1%_0.0625W_100PPM; Component Kind: Standard; Component Type: Standard; Pin Count: 2; Value: 13k; Status: Not Recommended; Power: 0.0625W; Manufacturer Part Number: R0402_13K_1%_0.0625W_100PPM; Case: 0402; Mounted: Yes; Sense: No; Socket: No; SMD: Yes; Manufacturer1 Example: YAGEO PHYCOMP; Manufacturer1 ComponentHeight: 0.4mm; HelpURL: \\cern.ch\dfs\Applications\Altium\Datasheets\R0402_Phycomp_RC0402.pdf; Author: CERN DEM JLC; CreateDate: 03.12.2007; LatestRevisionDate: 17.10.2012
R105 = R0402_10K_1%_0.0625W_100PPM: Resistor - 1%; Part Description: General Purpose Thick Film Chip Resistor; Manufacturer: GENERIC; Manufacturer1 Part Number: 232270671003L; TC: ±100ppm/°C; PressFit: No; Part Number: R0402_10K_1%_0.0625W_100PPM; Component Kind: Standard; Component Type: Standard; Pin Count: 2; Value: 10k; Status: Not Recommended; Power: 0.0625W; Tolerance: ±1%; Manufacturer Part Number: R0402_10K_1%_0.0625W_100PPM; Case: 0402; Mounted: Yes; Socket: No; SMD: Yes; Manufacturer1 Example: YAGEO PHYCOMP; Manufacturer1 ComponentHeight: 0.4mm; HelpURL: \\cern.ch\dfs\Applications\Altium\Datasheets\R0402_Phycomp_RC0402.pdf; Author: CERN DEM JLC; CreateDate: 03.12.2007; LatestRevisionDate: 17.10.2012; Sense: No
T4 = Q_IRF9310: PMOS 30V, 4.6mR, 20A, 2.5W
T5 T8 = BSS138LT1G: N-CHANNEL MOSFET WITH DIODE; Part Description: 50V 200mA N-Channel Enhancement Mode Field-Effect Transistor; Manufacturer: ON SEMICONDUCTOR; PressFit: No; Bonding: No; Part Number: BSS138LT1G; Component Kind: Standard; Component Type: Standard; Device: BSS138LT1G; PackageDescription: SOT23 3-Leads, Pitch 0.95mm - Body 1.4x3mm, IPC Medium Density; Manufacturer Part Number: BSS138LT1G; Pin Count: 3; Case: SOT23-3; Mounted: Yes; Socket: No; SMD: Yes; Sense: No; ComponentHeight: 1.11mm; HelpURL: \\cern.ch\dfs\Applications\Altium\Datasheets\BSS138LT1G.pdf; Author: CERN DEM JLC; CreateDate: 3/23/2009; LatestRevisionDate: 3/23/2009
T6 = IRLML6402PBF: P-CHANNEL MOSFET WITH ZENER DIODE; Part Description: -20V -3.7A P-Channel HEXFET® Power MOSFET; Manufacturer: INTERNATIONAL RECTIFIER; PressFit: No; Bonding: No; Part Number: IRLML6402PBF; Component Kind: Standard; Component Type: Standard; Device: IRLML6402PBF; PackageDescription: SOT, 0.95mm, pitch; 3 pin,1.30mm W X 2.92mm L X 1.12mm H body, IPC Medium Density; Manufacturer Part Number: IRLML6402PBF; Pin Count: 3; Case: SOT23-3; Mounted: Yes; Socket: No; SMD: Yes; Sense: No; ComponentHeight: 1.12mm; HelpURL: \\cern.ch\dfs\Applications\Altium\Datasheets\IRLML6402PBF.pdf; Author: CERN DEM JLC; CreateDate: 8/29/2011; LatestRevisionDate: 8/29/2011
TP3 TP4 = TP: Testpoint

## Sheet clocking.SchDoc: Clocking
size 420 x 297 mm; Author: G.Kasprowicz; CompanyName: WUT ISE; DrawnBy: G.Kasprowicz; Organization: WUT ISE; Address1: PW ISE; Address2: Nowowiejska 15/19 00-665 Warsaw; Address3: gkasprow@gmail.com; DocumentNumber: 3; Revision: 2; SheetNumber: 3; SheetTotal: 18; ModifiedBy: -; CheckedDate: -; DivGrp: WUT ISE; Designer: G.Kasprowicz; ModifiedDate: -; ProjectName: Sensor Box
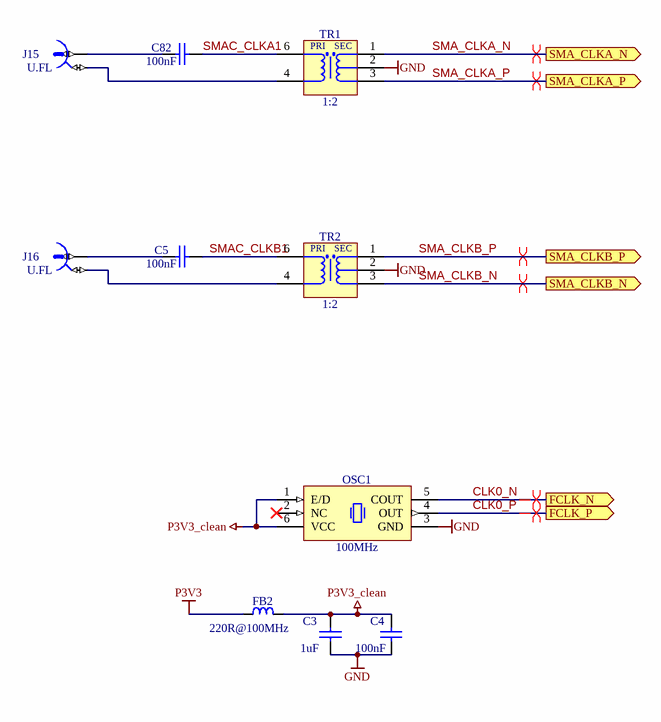
[diagram p2: clocking.SchDoc]

### Parts
C3  1uF  [CAPC1608X87N]
C4  100nF  [CAPC1005X55N]
C5  100nF  [CAPC1005X55N]
C82  100nF  [CAPC1005X55N]
FB2  220R@100MHz  [INDC2012X105N]
J15  U.FL  [HIROSE_U.FL-R-SMT-1(10)]
J16  U.FL  [HIROSE_U.FL-R-SMT-1(10)]
OSC1  100MHz  [OSC_CRYSTEK_CCLD-033]
TR1  1:2  [XFMR_MINI-CIRCUITS_AT1521]
TR2  1:2  [XFMR_MINI-CIRCUITS_AT1521]

### Ports
FCLK_N (out), FCLK_P (out), SMA_CLKA_N (out), SMA_CLKA_P (out), SMA_CLKB_N (out), SMA_CLKB_P (out)

### Nets
GND: C3.1 C4.1 OSC1.3(GND) TR1.2(NC) TR2.2(NC)
P3V3: FB2.1
P3V3_clean: C3.2 C4.2 FB2.2 OSC1.1(E/D) OSC1.6(VCC)
CLK0_N: OSC1.5(COUT) ; port FCLK_N
CLK0_P: OSC1.4(OUT) ; port FCLK_P
SMA_CLKA_N: TR1.1(SDOT) ; port SMA_CLKA_N
SMA_CLKA_P: TR1.3(S) ; port SMA_CLKA_P
SMA_CLKB_N: TR2.3(S) ; port SMA_CLKB_N
SMA_CLKB_P: TR2.1(SDOT) ; port SMA_CLKB_P
SMAC_CLKA1: C82.1 TR1.6(PDOT)
SMAC_CLKB1: C5.1 TR2.6(PDOT)
NetC5_2: C5.2 J16.1
NetC82_2: C82.2 J15.1
NetJ15_2: J15.2 TR1.4(P)
NetJ16_2: J16.2 TR2.4(P)

Not connected (* = marked no-connect by the designer): OSC1 2(NC)*

### Layout directives
differential pair: CLK0_N, CLK0_P, SMA_CLKA_N, SMA_CLKA_P, SMA_CLKB_N, SMA_CLKB_P

### Notes on the sheet
- Project/Equipment
- Document
- Designer
- Drawn by
- Check.by
- Copyright WUT ISE 2020.
  This documentation describes Open Hardware and is licensed under the CERN OHL v.1.2. You may redistribute and modify this documentation under the terms of the CERN OHL v.1.2. (http://ohwr.org/CERNOHL). This documentation is distributed WITHOUT ANY EXPRESS OR IMPLIED WARRANTY, INCLUDING OF MERCHANTABILITY, SATISFACTORY QUALITY AND FITNESS FOR A PARTICULAR PURPOSE. Please see the CERN OHL v.1.2 for applicable conditions.
- Contact
- File
- Last Mod.
- Print Date
- Sheet
- Size
- A3
- of
- Rev
- (in symbol XFMR_MINI-CIRCUITS_TC2-72T+) PRI; SEC

### Library data of the parts
C3 = CC0603_1UF_25V_10%_X7R: Non-polarised capacitor; Part Description: SMD Multilayer Chip Ceramic Capacitor; Manufacturer: GENERIC; Manufacturer1 Part Number: GRM188R71E105KA12D; Voltage: 25V; TC: X7R; Tolerance: ±10%; Table: Capacitors SMD; Part Number: CC0603_1UF_25V_10%_X7R; Component Kind: Standard; Component Type: Standard; Pin Count: 2; Value: 1uF; Status: None; Manufacturer Part Number: CC0603_1UF_25V_10%_X7R; Case: 0603; Mounted: Yes; Socket: No; SMD: Yes; Manufacturer1 Example: MURATA; Manufacturer1 ComponentHeight: 0.9mm; HelpURL: \\cern.ch\dfs\Applications\Altium\Datasheets\CC0603_X7R_MURATA.pdf; Author: CERN DEM JLC; CreateDate: 2011-01-18; LatestRevisionDate: 2011-01-18
C4 = CC0402_100NF_16V_10%_X5R: Non-polarised capacitor; Part Description: SMD Multilayer Chip Ceramic Capacitor; Manufacturer: GENERIC; Manufacturer1 Part Number: GRM155R61C104KA88D; Voltage: 16V; TC: X5R; Tolerance: ±10%; Part Number: CC0402_100NF_16V_10%_X5R; Component Kind: Standard; Component Type: Standard; Pin Count: 2; Value: 100nF; Status: None; Manufacturer Part Number: CC0402_100NF_16V_10%_X5R; Case: 0402; Mounted: Yes; Socket: No; SMD: Yes; Manufacturer1 Example: MURATA; Manufacturer1 ComponentHeight: 0.55mm; HelpURL: \\cern.ch\dfs\Applications\Altium\Datasheets\CC0402_X5R_MURATA_GRM.pdf; Author: CERN DEM JLC; CreateDate: 10.12.2013; LatestRevisionDate: 10.12.2013; Sense: No
C5 C82 = CC0402_100NF_16V_10%_X5R: as C18 on sheet Supply; Part Number: CC0402_100NF_16V_10%_X5R; Component Kind: Standard; Component Type: Standard; Pin Count: 2; Value: 100nF; Status: None; Manufacturer Part Number: CC0402_100NF_16V_10%_X5R; Case: 0402; Mounted: Yes; Socket: No; SMD: Yes; Manufacturer1 Example: MURATA; Manufacturer1 ComponentHeight: 0.55mm; HelpURL: \\cern.ch\dfs\Applications\Altium\Datasheets\CC0402_X5R_MURATA_GRM.pdf; Author: CERN DEM JLC; CreateDate: 2013-12-10; LatestRevisionDate: 2013-12-10
FB2 = IND0805_MURATA_BLM21PG221SN1D: Inductor; Part Description: SMD EMIFIL Suppression Chip Ferrite Bead; Manufacturer: MURATA; Power: 2A; Resistance: 0.05R; Tolerance: ±25%; Table: Inductors SMD; Part Number: IND0805_MURATA_BLM21PG221SN1D; Component Kind: Standard; Component Type: Standard; Pin Count: 2; Value: 220R@100MHz; Status: None; Manufacturer Part Number: BLM21PG221SN1D; Case: 0805; Mounted: Yes; Socket: No; SMD: Yes; ComponentHeight: 1.05mm; HelpURL: \\cern.ch\dfs\Applications\Altium\Datasheets\IND0402_MURATA_BLM21P.pdf; Author: CERN DEM JLC; CreateDate: 2010-01-25; LatestRevisionDate: 2010-01-25
J15 J16 = HIROSE_U.FL-R-SMT-1(10): Part Description: Up to 6GHz Ultra Small Surface Mount Male Coaxial Connectors U.FL Series; Manufacturer: HIROSE (HRS); PressFit: No; Part Number: HIROSE_U.FL-R-SMT-1(10); Component Kind: Standard; Component Type: Standard; Pin Count: 2; Family: U.FL; Mounted: Yes; Socket: No; SMD: Yes; Sense: No; Status: None; Manufacturer Part Number: U.FL-R-SMT-1(10); ComponentHeight: 1.25mm; HelpURL: \\cern.ch\dfs\Applications\Altium\Datasheets\HIROSE_U.FL-R-SMT-1(10).pdf; Author: CERN DEM JLC; CreateDate: 24.03.2010; LatestRevisionDate: 24.03.2010
OSC1 = OSC_100MHZ_CRYSTEK_CCLD-033-50-100.000: 3.3V, ± 50ppm, 0°C to +70°C, Surface Mount LVDS Clock Oscillator (CCLD-033 Series); Manufacturer: CRYSTEK CRYSTAL; PressFit: No; Bonding: No; Part Number: OSC_100MHZ_CRYSTEK_CCLD-033-50-100.000; Component Kind: Standard; Component Type: Standard; PackageDescription: Oscillator, Side Concave, 2.54mm Pitch, 6 Pins, 5.00mm L X 7.00mm W X 1.80mm H, CCLD-033 Series; Value: 100MHz; Part Description: 3.3V, ± 50ppm, 0°C to +70°C, Surface Mount LVDS Clock Oscillator (CCLD-033 Series); Manufacturer Part Number: CCLD-033-50-100.000; Pin Count: 6; Mounted: Yes; Socket: No; SMD: Yes; Sense: No; ComponentHeight: 1.8mm; HelpURL: \\cern.ch\dfs\Applications\Altium\Datasheets\OSC_CRYSTEK_CCLD-033.pdf; Author: CERN DEM JLC; CreateDate: 23.02.2017; LatestRevisionDate: 23.02.2017
TR1 TR2 = XFMR_MINI-CIRCUITS_TC2-72T+: 50 Ohms 10 to 700 MHzz RF Transformer; Part Description: 50 Ohms 10 to 700MHz RF Transformer; Manufacturer: MINI-CIRCUITS; Manufacturer Part Number: TC2-72T+; HelpURL: \\cern.ch\dfs\Applications\Altium\Datasheets\XFMR_MINI-CIRCUITS_TC2-1TX+.pdf; Part Number: XFMR_MINI-CIRCUITS_TC2-72T+; Component Kind: Standard; Component Type: Standard; Pin Count: 5; Value: 1:2; Status: None; Mounted: Yes; Socket: No; Sense: No; SMD: Yes; ComponentHeight: 4.06mm; Author: GK; CreateDate: 18.10.2019; LatestRevisionDate: 18.10.2019